# EAGLE design attiny45-microcontrol-v3.0 (EAGLE 6.4)
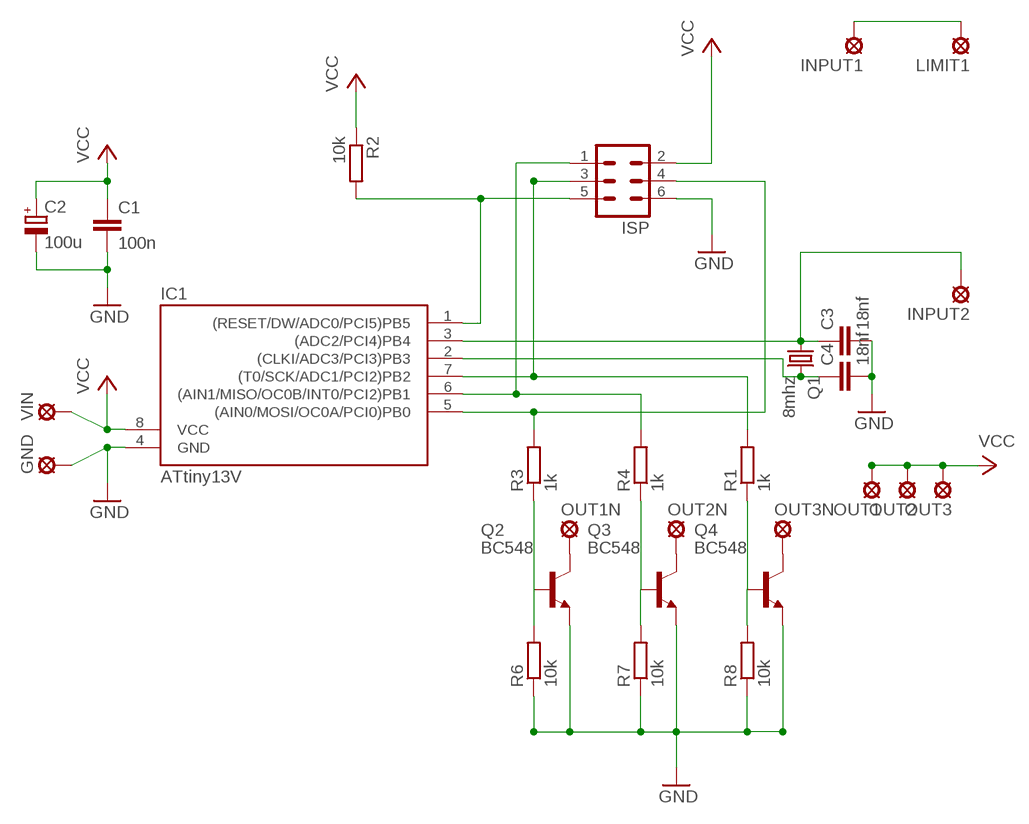
[diagram p0: schematic, sheet 1]

## Parts
C1  100n  C-EU025-025X050  [C025-025X050]
C2  100u  CPOL-EUE2,5-6E  [E2,5-6E]
C3  18nf  C5/2.5  [C5B2.5]
C4  18nf  C5/2.5  [C5B2.5]
GND  LSP10  [LSP10]
IC1  ATtiny13V  ATTINY13-20P  [DIL08]
INPUT1  LSP10  [LSP10]
INPUT2  LSP10  [LSP10]
ISP  MA03-2  [MA03-2]
LIMIT1  LSP10  [LSP10]
OUT1  LSP10  [LSP10]
OUT1N  LSP10  [LSP10]
OUT2  LSP10  [LSP10]
OUT2N  LSP10  [LSP10]
OUT3  LSP10  [LSP10]
OUT3N  LSP10  [LSP10]
Q1  8mhz  CRYSTALHC18U-V  [HC18U-V]
Q2  BC548  [TO92-EBC]
Q3  BC548  [TO92-EBC]
Q4  BC548  [TO92-EBC]
R1  1k  R-EU_0204/7  [0204/7]
R2  10k  R-EU_0204/2V  [0204V]
R3  1k  R-EU_0204/7  [0204/7]
R4  1k  R-EU_0204/7  [0204/7]
R6  10k  R-EU_0204/2V  [0204V]
R7  10k  R-EU_0204/2V  [0204V]
R8  10k  R-EU_0204/2V  [0204V]
VIN  LSP10  [LSP10]

## Nets
GND: C1.2 C2.- C3.2 C4.2 GND.MP IC1.4(GND) ISP.6 Q2.E Q3.E Q4.E R6.1 R7.1 R8.1
N$1: Q2.B R3.1 R6.2
N$2: C4.1 IC1.2((CLKI/ADC3/PCI3)PB3) Q1.2
N$3: IC1.1((RESET/DW/ADC0/PCI5)PB5) ISP.5 R2.2
N$4: Q3.B R4.1 R7.2
N$5: IC1.7((T0/SCK/ADC1/PCI2)PB2) ISP.3 R1.2
N$6: IC1.6((AIN1/MISO/OC0B/INT0/PCI2)PB1) ISP.1 R4.2
N$7: Q4.B R1.1 R8.2
N$8: C3.1 IC1.3((ADC2/PCI4)PB4) INPUT2.MP Q1.1
N$9: INPUT1.MP LIMIT1.MP
N$10: IC1.5((AIN0/MOSI/OC0A/PCI0)PB0) ISP.4 R3.2
N$11: OUT3N.MP Q4.C
N$12: OUT2N.MP Q3.C
N$13: OUT1N.MP Q2.C
VCC: C1.1 C2.+ IC1.8(VCC) ISP.2 OUT1.MP OUT2.MP OUT3.MP R2.1 VIN.MP

## Library data of the parts
C1 = rcl:C-EU: CAPACITOR, European symbol
C2 = rcl:CPOL-EU: POLARIZED CAPACITOR, European symbol
C3 C4 = capacitor-wima:C: CAPACITOR naming: grid - package width
GND INPUT1 INPUT2 LIMIT1 OUT1 OUT1N OUT2 OUT2N OUT3 OUT3N VIN = solpad:LSP10: SOLDER PAD drill 1.0 mm, distributor Buerklin, 12H555
IC1 = avr:ATTINY13: MICROCONTROLLER 1 Kbytes FLASH 64 bytes EEPROM 64 bytes RAM 4-channel 10 bit ADC
ISP = con-lstb:MA03-2: PIN HEADER
Q1 = crystal:CRYSTAL: CRYSTAL; OC_FARNELL: unknown; OC_NEWARK: unknown
Q2-Q4 = transistor-npn:BC548*: NPN Transistor
R1-R4 R6-R8 = rcl:R-EU_: RESISTOR, European symbol

## Net classes
0 default: clearance 0.355 mm

## Board
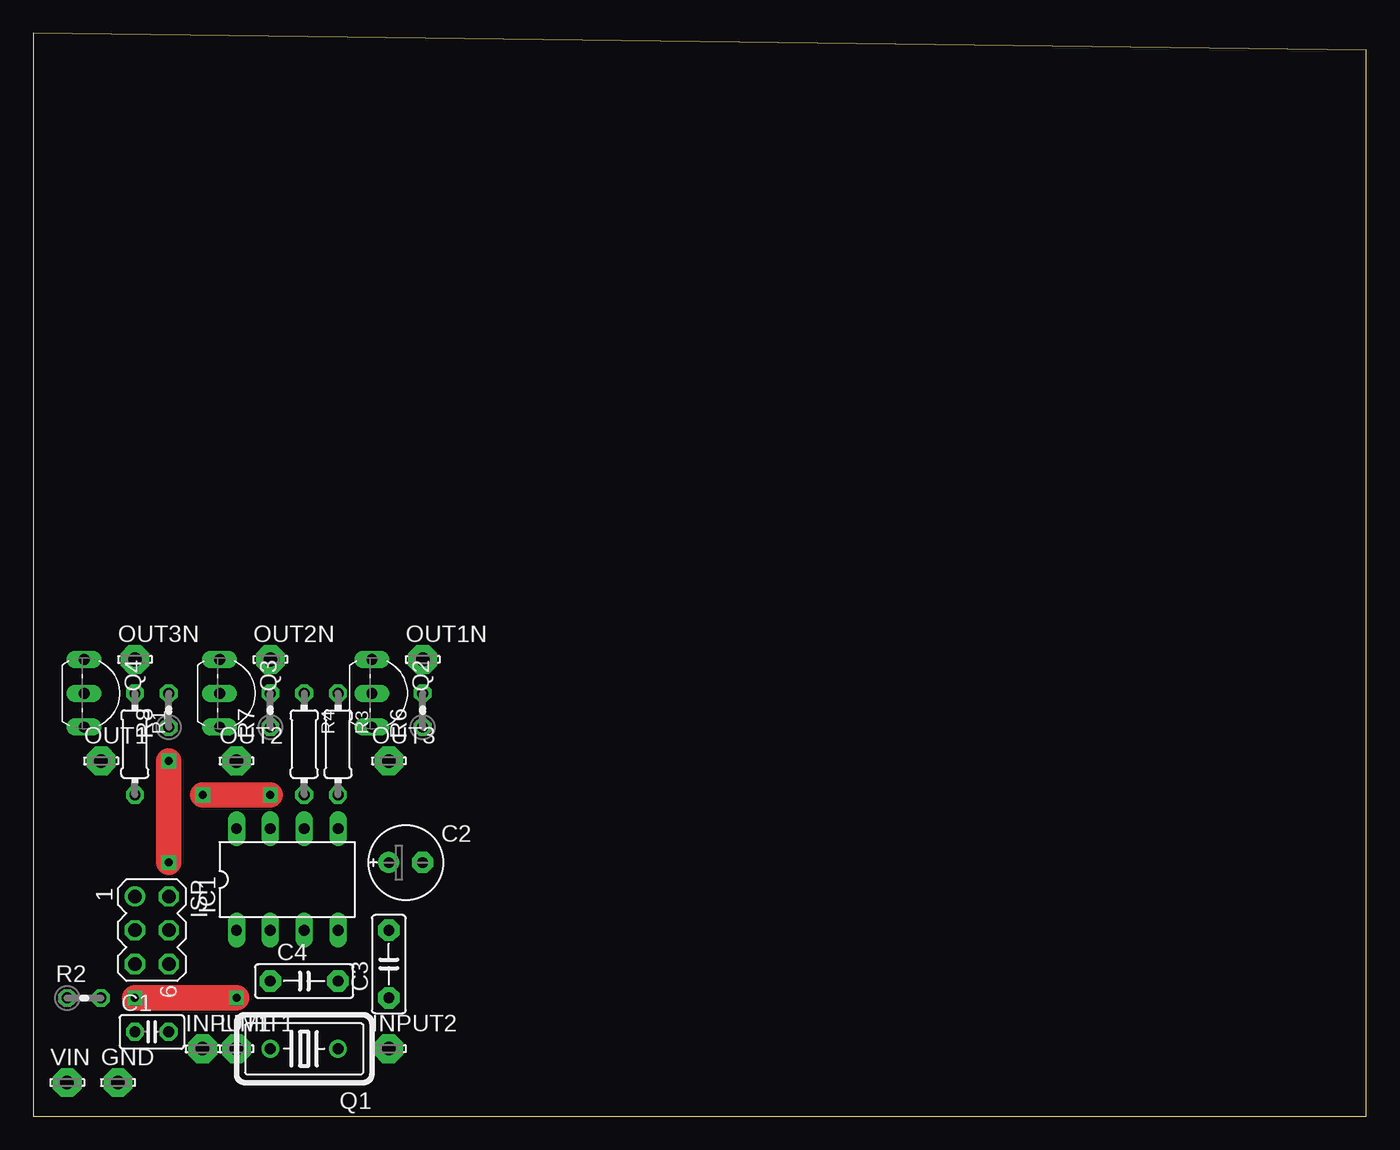
[diagram p1: board, top side]
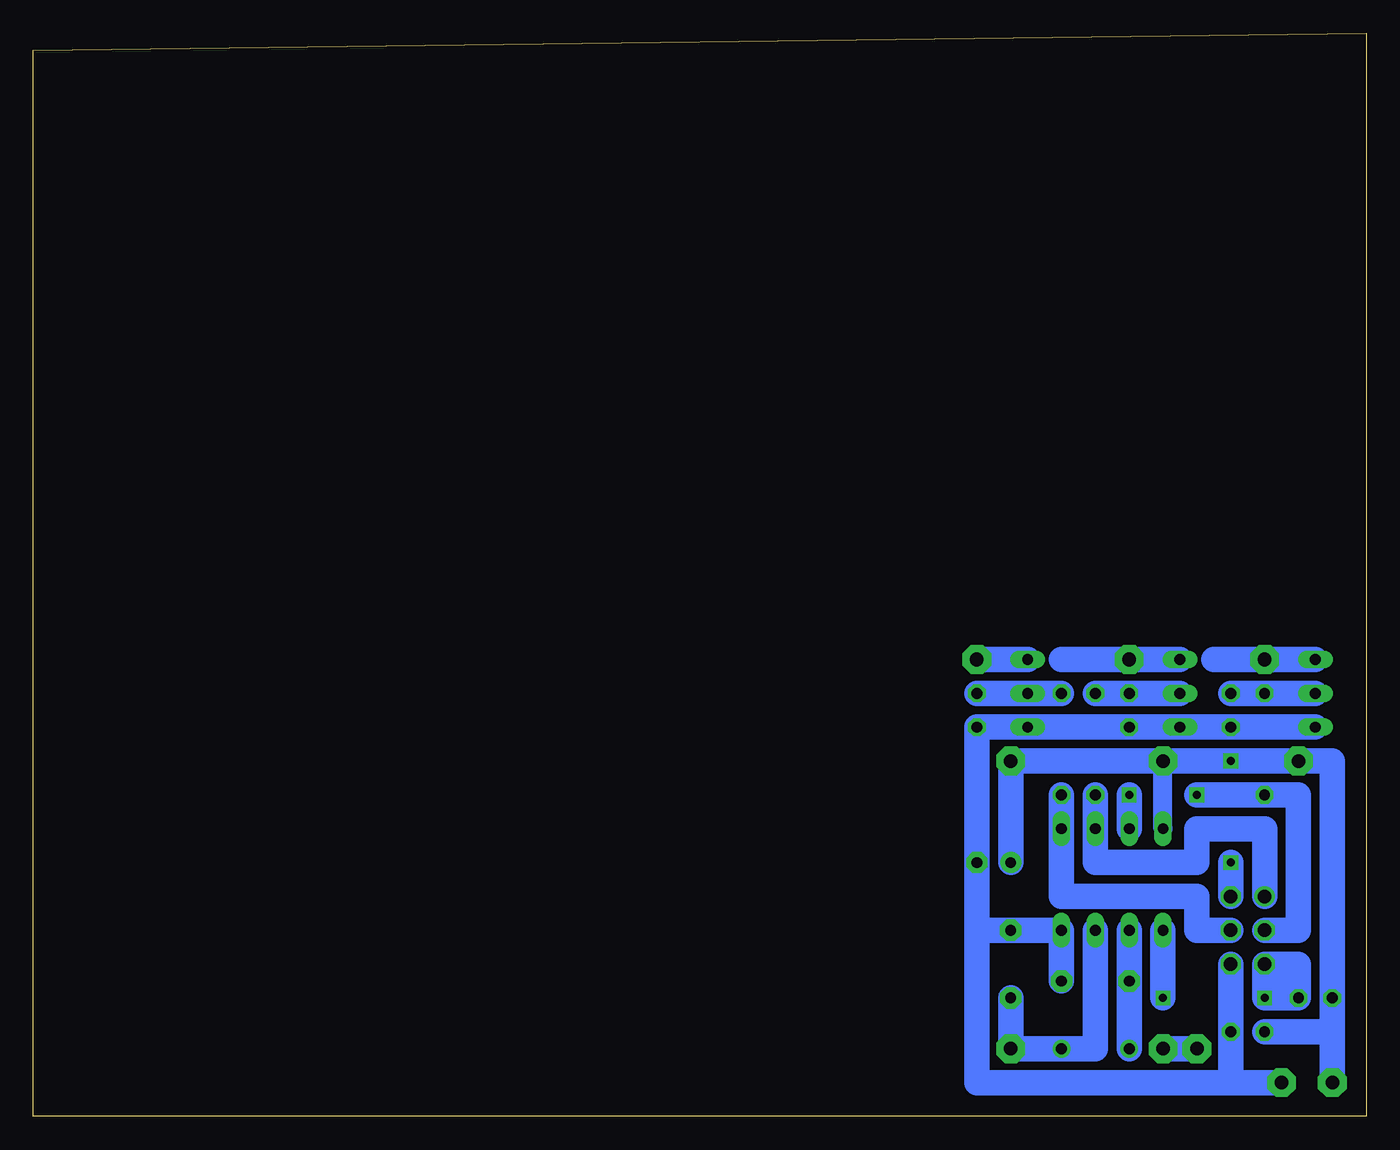
[diagram p2: board, bottom side, seen from below]

Size 100 x 81.27 mm. Coordinates in mm from the lower left corner, seen from the top.
Outline: 0,0 100,0 100,80 0,81.27 0,0
Copper layers (1*16): Top 0.035mm / dielectric 1.5mm / Bottom 0.035mm
Design rules "default *": minimum track width 10mil, minimum drill 24mil, track to track 8mil, track to pad 8mil, pad to pad 8mil, via to via 8mil, smd to smd 8mil, copper to edge 40mil, drill to drill 8mil, minimum pad ring 10mil, minimum via ring 10mil, stop-mask expansion 4mil, vias tented up to drill 0mil, thermal gap 10mil

### Footprints (pad centres in the part's own frame; a part is rotated, then mirrored left to right if it is on the bottom)
C025-025X050 = drill 0.813 octagon: 1 -1.27,0; 2 1.27,0
E2,5-6E = drill 0.813 pad 1.575: + -1.27,0 | drill 0.813 pad 1.575 octagon: - 1.27,0
C5B2.5 = drill 0.813 pad 1.6 octagon: 1 -2.54,0; 2 2.54,0
LSP10 = drill 1.016 pad 2.159 octagon: MP 0,0
DIL08 = drill 0.813 long: 1 -3.81,-3.81; 2 -1.27,-3.81; 3 1.27,-3.81; 4 3.81,-3.81; 5 3.81,3.81; 6 1.27,3.81; 7 -1.27,3.81; 8 -3.81,3.81
MA03-2 = drill 1.016: 1 -2.54,-1.27 | drill 1.016 octagon: 2 -2.54,1.27; 3 0,-1.27; 4 0,1.27; 5 2.54,-1.27; 6 2.54,1.27
HC18U-V = drill 0.813: 1 -2.54,0; 2 2.54,0
TO92-EBC = drill 0.813 long: B 0,-1.27; C -2.54,-1.27; E 2.54,-1.27
0204/7 = drill 0.813 octagon: 1 -3.81,0; 2 3.81,0
0204V = drill 0.813 octagon: 1 -1.27,0; 2 1.27,0

### Placement (x,y rotation side)
C1  8.89,6.35 0 top
C2  27.94,19.05 0 top
C3  26.67,11.43 90 top
C4  20.32,10.16 0 top
GND  6.35,2.54 0 top
IC1  19.05,17.78 0 top
INPUT1  12.7,5.08 0 top
INPUT2  26.67,5.08 0 top
ISP  8.89,13.97 270 top
LIMIT1  15.24,5.08 0 top
OUT1  5.08,26.67 0 top
OUT1N  29.21,34.29 0 top
OUT2  15.24,26.67 0 top
OUT2N  17.78,34.29 0 top
OUT3  26.67,26.67 0 top
OUT3N  7.62,34.29 0 top
Q1  20.32,5.08 180 top
Q2  26.67,31.75 270 top
Q3  15.24,31.75 270 top
Q4  5.08,31.75 270 top
R1  7.62,27.94 270 top
R2  3.81,8.89 0 top
R3  22.86,27.94 270 top
R4  20.32,27.94 270 top
R6  29.21,30.48 90 top
R7  17.78,30.48 90 top
R8  10.16,30.48 90 top
VIN  2.54,2.54 0 top

### Tracks (layer width: path | path; a pad name or v marks a point on that pad's centre or on a via)
GND
  Bottom 1.93: 10.16,2.54 C1.2 ISP.6 | 10.16,2.54 29.21,2.54 29.21,13.97 | C4.2 IC1.4 C3.2 29.21,13.97 | 29.21,13.97 C2.- R6.1 Q2.E R7.1 Q3.E R8.1 Q4.E | GND.MP 10.16,2.54
N$1
  Bottom 1.93: R3.1 Q2.B R6.2
N$2
  Bottom 1.93: IC1.2 C4.1 Q1.2
N$3  (via drill 0.6)
  Top 1.93: v15.24,8.89 v7.62,8.89
  Bottom 1.93: IC1.1 v15.24,8.89 | R2.2 v7.62,8.89 ISP.5 5.08,11.43 R2.2 | R2.2 6.35,8.89 6.35,10.16
N$4
  Bottom 1.93: R4.1 R7.2 Q3.B
N$5  (via drill 0.6)
  Top 1.93: v17.78,24.13 v12.7,24.13
  Bottom 1.93: ISP.3 5.08,13.97 5.08,24.13 R1.2 v12.7,24.13 | IC1.7 v17.78,24.13
N$6
  Bottom 1.93: ISP.1 7.62,21.59 12.7,21.59 12.7,19.05 20.32,19.05 IC1.6 R4.2
N$7
  Bottom 1.93: Q4.B R1.1 R8.2
N$8
  Bottom 1.93: IC1.3 20.32,5.08 Q1.1 INPUT2.MP C3.1
N$9
  Bottom 1.93: INPUT1.MP LIMIT1.MP
N$10
  Bottom 1.93: ISP.4 12.7,13.97 12.7,16.51 22.86,16.51 IC1.5 R3.2
N$11
  Bottom 1.93: Q4.C OUT3N.MP 11.43,34.29
N$12
  Bottom 1.93: Q3.C OUT2N.MP 22.86,34.29
N$13
  Bottom 1.93: Q2.C OUT1N.MP
VCC  (via drill 0.6)
  Top 1.93: v10.16,26.67 v10.16,19.05
  Bottom 1.422: IC1.8 OUT2.MP
  Bottom 1.93: ISP.2 v10.16,19.05 | 2.54,6.35 R2.1 2.54,26.67 OUT1.MP v10.16,26.67 OUT2.MP OUT3.MP C2.+ | 2.54,6.35 C1.1 | VIN.MP 2.54,6.35